# EasyEDA schematic SCH_Gps sim locator_2022-06-02.json
TITLE: GPS sim locator; REV: 1.0; Date: 2022-05-09; Sheet: 1/1; Drawn By: Kryštof Olík; Company: Olik Atomik
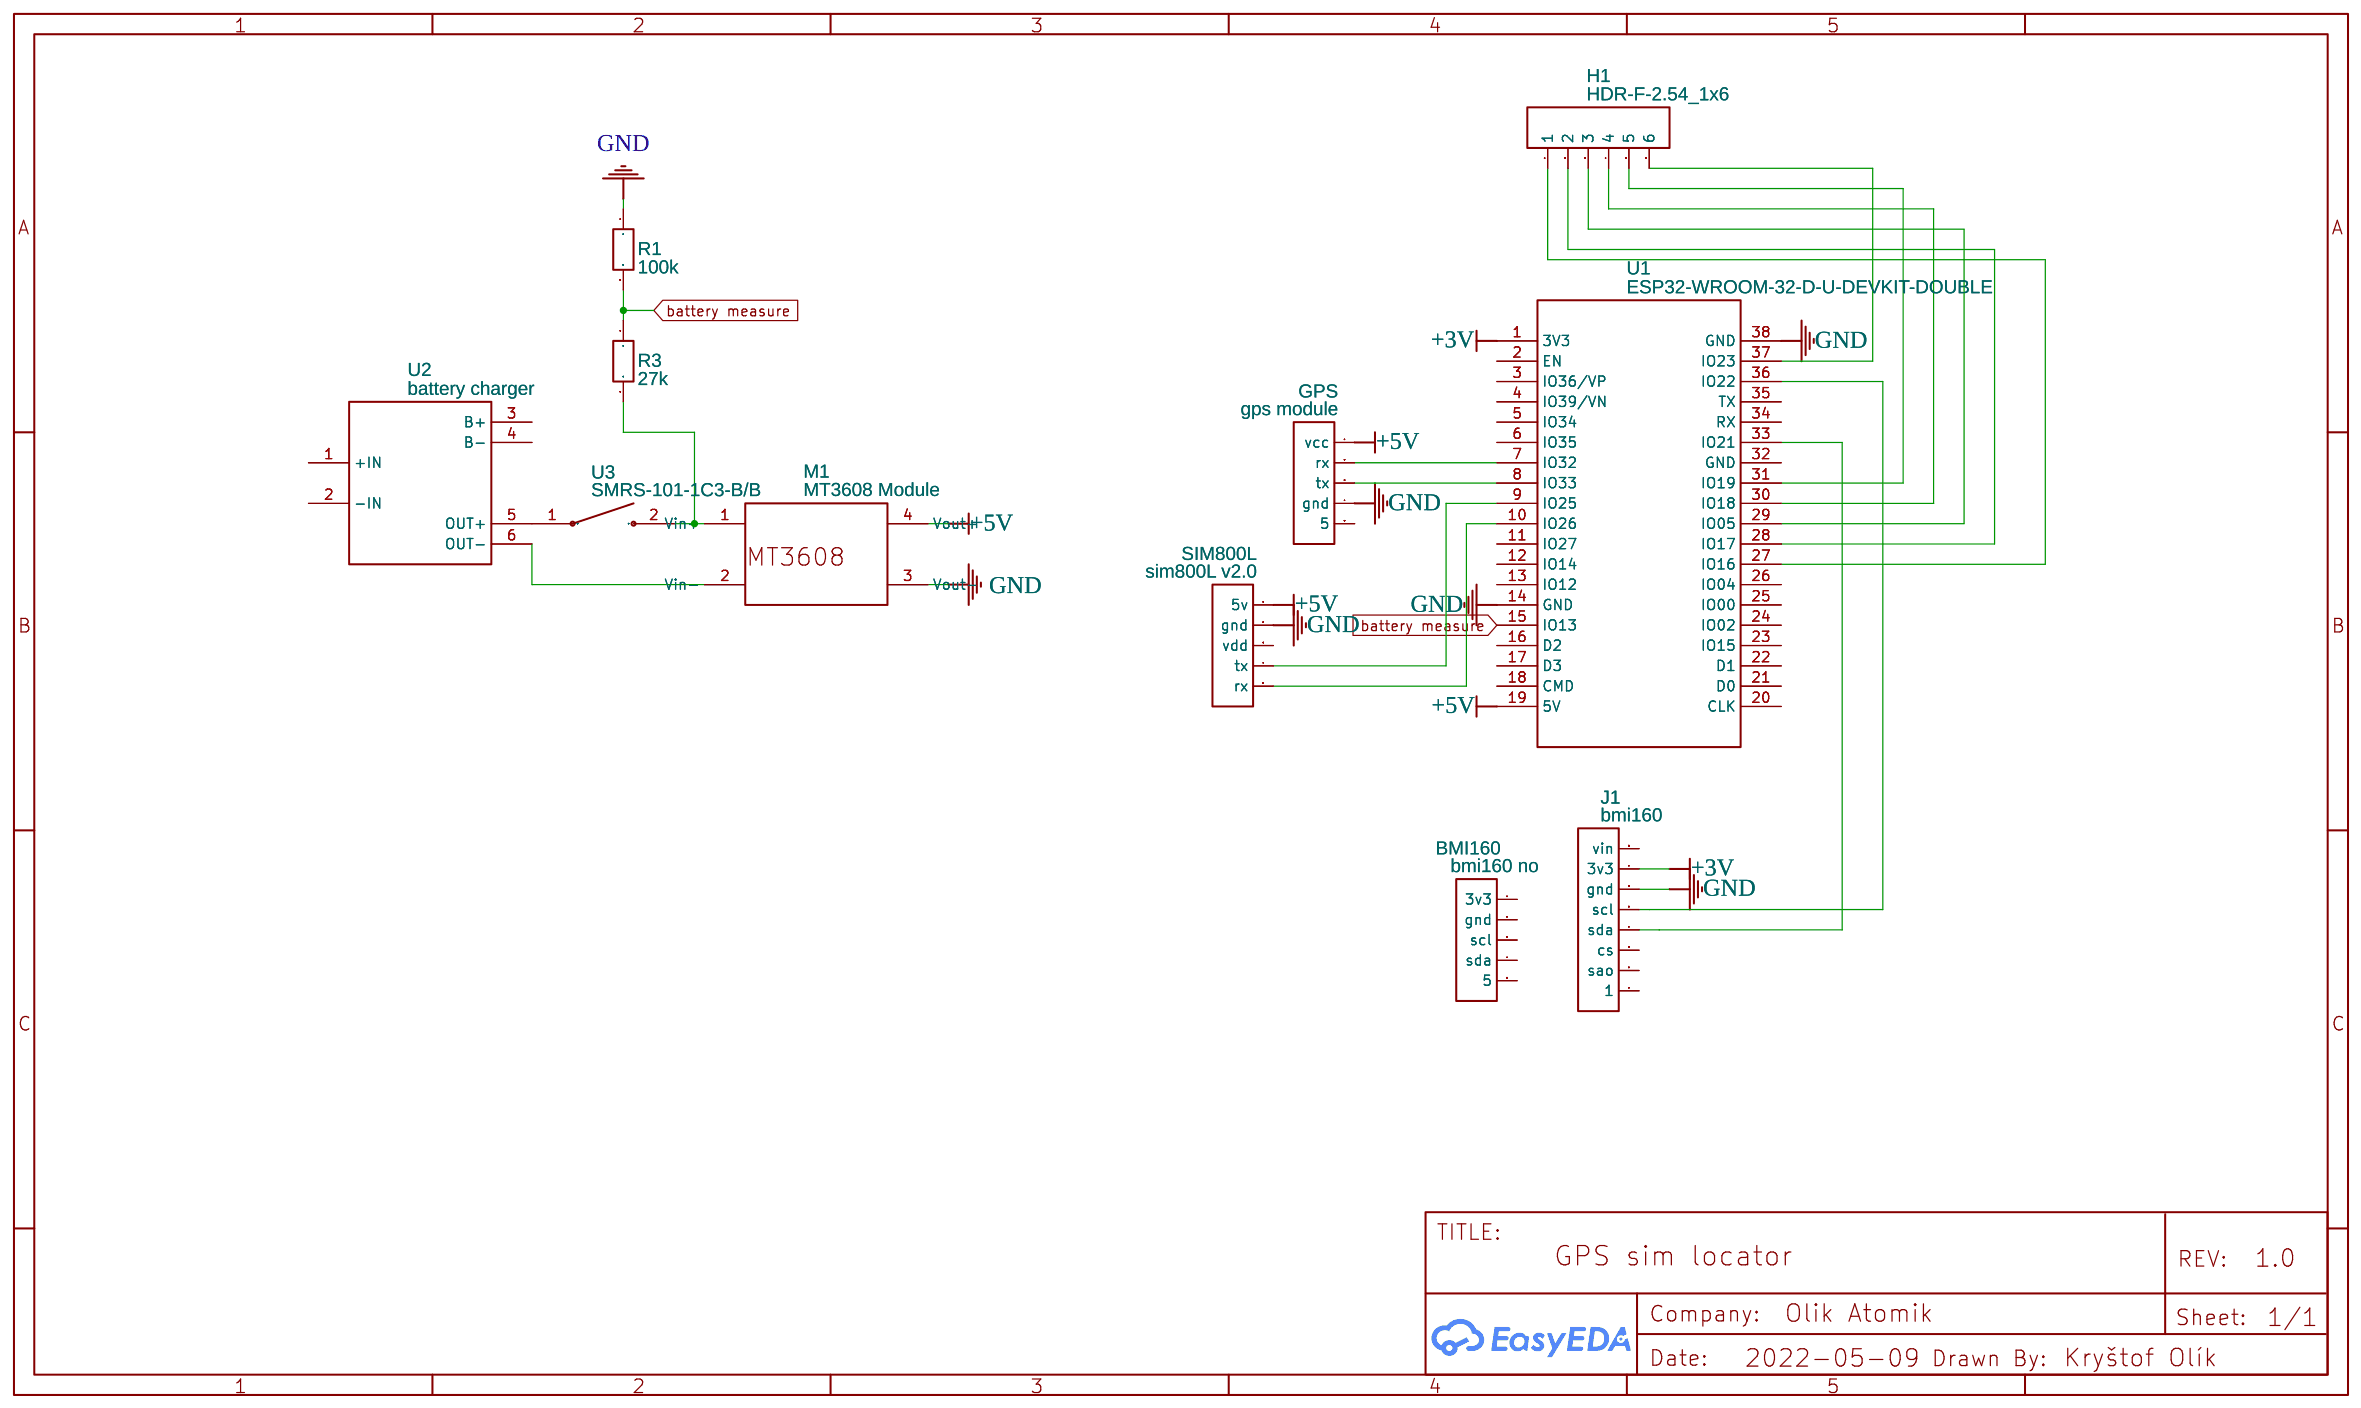
[diagram p0: schematic sheet]

## Parts
BMI160  bmi160 no  [HDR-F-2.54_1X5]
GPS  gps module  [HDR-F-2.54_1X5]
H1  HDR-F-2.54_1x6  [HDR-F-2.54_1X6]
J1  bmi160  [HDR-M-2.54_1X8]
M1  MT3608 Module  [MT3608]
R1  100k  [R_AXIAL-0.3]
R3  27k  [R_AXIAL-0.3]
SIM800L  sim800L v2.0  [HDR-F-2.54_1X5]
U1  ESP32-WROOM-32-D-U-DEVKIT-DOUBLE  [ESP32-WROOM-32-D-U-DEVKIT]
U2  battery charger  [TP4056]
U3  SMRS-101-1C3-B/B  [SMRS-101-1C3-B/B]

## Library data of the parts
BMI160 GPS SIM800L = HDR-F-2.54_1x5: Supplier Part: C50950; Supplier: LCSC; Contributor: LCEDA_Lib
H1 = HDR-F-2.54_1x6: Supplier Part: C40877; Supplier: LCSC; Contributor: LCEDA_Lib
J1 = HDR-M-2.54_1x8: Supplier Part: C190820; Supplier: LCSC; Contributor: LCEDA_Lib
M1 = MT3608 Module: link: https://www.banggood.com/1pcs-MT3608-2A-DC-DC-Adjustable-Step-Up-Power-Module-Booster-Power-Module-p-1213134.html?rmmds=myorder&cur_warehouse=CN; Contributor: stmo
R1 R3 = R_AXIAL-0.3_EU: Contributor: LCEDA_Lib
U1 = ESP32-WROOM-32-D-U-DEVKIT-DOUBLE: Contributor: KOXOV
U2 = TP4056 COPY: Contributor: Manuel Velásquez
U3 = SMRS-101-1C3-B/B: link: https://static.chipdip.ru/lib/955/DOC002955067.pdf; Contributor: ondrej.major

## Nets
+3V: J1.7(3v3) U1.1(3V3)
+5V: GPS.1(vcc) M1.4(Vout+) SIM800L.1(5v) U1.19(5V)
GND: GPS.4(gnd) J1.6(gnd) M1.3(Vout-) R1.1 SIM800L.2(gnd) U1.14(GND) U1.38(GND)
battery measure: R1.2 R3.1 U1.15(IO13)
Net-(GPS-2): GPS.2(rx) U1.7(IO32)
Net-(GPS-3): GPS.3(tx) U1.8(IO33)
Net-(H1-1): H1.1 U1.27(IO16)
Net-(H1-2): H1.2 U1.28(IO17)
Net-(H1-3): H1.3 U1.29(IO05)
Net-(H1-4): H1.4 U1.30(IO18)
Net-(H1-5): H1.5 U1.31(IO19)
Net-(H1-6): H1.6 U1.37(IO23)
Net-(J1-4): J1.4(sda) U1.33(IO21)
Net-(J1-5): J1.5(scl) U1.36(IO22)
Net-(M1-2): M1.2(Vin-) U2.6(OUT-)
Net-(R3-2): R3.2 U3.2
Net-(SIM800L-4): SIM800L.4(tx) U1.9(IO25)
Net-(SIM800L-5): SIM800L.5(rx) U1.10(IO26)
Net-(U2-5): U2.5(OUT+) U3.1(in)

Not connected (* = marked no-connect by the designer): BMI160 1(3v3) 2(gnd) 3(scl) 4(sda) 5; GPS 5; J1 1 2(sao) 3(cs) 8(vin); M1 1(Vin+); SIM800L 3(vdd); U1 2(EN) 3(IO36/VP) 4(IO39/VN) 5(IO34) 6(IO35) 11(IO27) 12(IO14) 13(IO12) 16(D2) 17(D3) 18(CMD) 20(CLK) 21(D0) 22(D1) 23(IO15) 24(IO02) 25(IO00) 26(IO04) 32(GND) 34(RX) 35(TX); U2 1(+IN) 2(-IN) 3(B+) 4(B-)
